# EAGLE schematic ver2.1 (EAGLE 7.1.0)
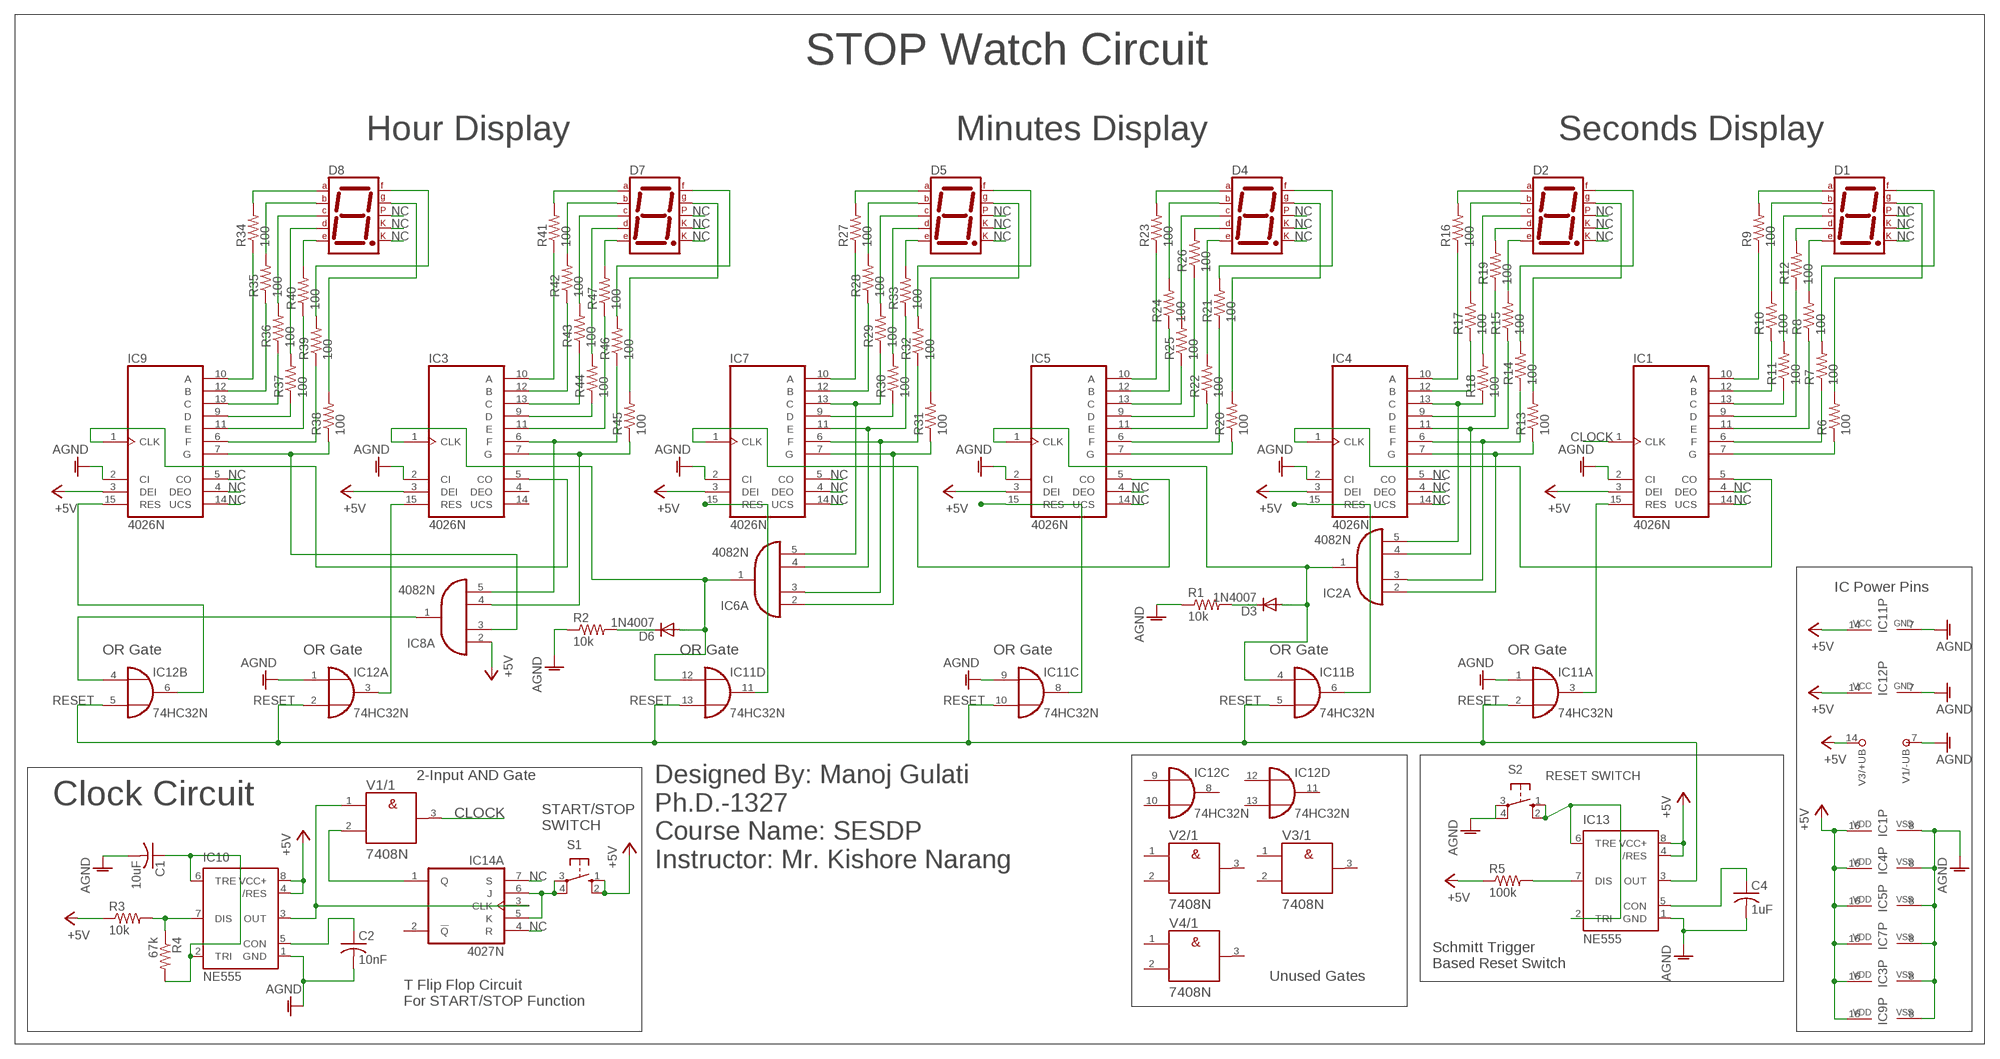
[diagram p0: schematic, sheet 1]

## Parts
C1  10uF  C-US025-024X044  [C025-024X044]
C2  10nF  C-US025-024X044  [C025-024X044]
C4  1uF  C-US025-024X044  [C025-024X044]
D1  7SEG-CK  [7SEG-13]
D2  7SEG-CK  [7SEG-13]
D3  1N4007  1N4004  [DO41-10]
D4  7SEG-CK  [7SEG-13]
D5  7SEG-CK  [7SEG-13]
D6  1N4007  1N4004  [DO41-10]
D7  7SEG-CK  [7SEG-13]
D8  7SEG-CK  [7SEG-13]
IC1  4026N  [DIL16]
IC2  4082N  [DIL14]
IC3  4026N  [DIL16]
IC4  4026N  [DIL16]
IC5  4026N  [DIL16]
IC6  4082N  [DIL14]
IC7  4026N  [DIL16]
IC8  4082N  [DIL14]
IC9  4026N  [DIL16]
IC10  NE555  [DIL-08]
IC11  74HC32N  [DIL14]
IC12  74HC32N  [DIL14]
IC13  NE555  [DIL-08]
IC14  4027N  [DIL16]
R1  10k  R-US_0204/2V  [0204V]
R2  10k  R-US_0204/2V  [0204V]
R3  10k  R-US_0204/2V  [0204V]
R4  67k  R-US_0204/2V  [0204V]
R5  100k  R-US_0204/2V  [0204V]
R6  100  R-US_0204/2V  [0204V]
R7  100  R-US_0204/2V  [0204V]
R8  100  R-US_0204/2V  [0204V]
R9  100  R-US_0204/2V  [0204V]
R10  100  R-US_0204/2V  [0204V]
R11  100  R-US_0204/2V  [0204V]
R12  100  R-US_0204/2V  [0204V]
R13  100  R-US_0204/2V  [0204V]
R14  100  R-US_0204/2V  [0204V]
R15  100  R-US_0204/2V  [0204V]
R16  100  R-US_0204/2V  [0204V]
R17  100  R-US_0204/2V  [0204V]
R18  100  R-US_0204/2V  [0204V]
R19  100  R-US_0204/2V  [0204V]
R20  100  R-US_0204/2V  [0204V]
R21  100  R-US_0204/2V  [0204V]
R22  100  R-US_0204/2V  [0204V]
R23  100  R-US_0204/2V  [0204V]
R24  100  R-US_0204/2V  [0204V]
R25  100  R-US_0204/2V  [0204V]
R26  100  R-US_0204/2V  [0204V]
R27  100  R-US_0204/2V  [0204V]
R28  100  R-US_0204/2V  [0204V]
R29  100  R-US_0204/2V  [0204V]
R30  100  R-US_0204/2V  [0204V]
R31  100  R-US_0204/2V  [0204V]
R32  100  R-US_0204/2V  [0204V]
R33  100  R-US_0204/2V  [0204V]
R34  100  R-US_0204/2V  [0204V]
R35  100  R-US_0204/2V  [0204V]
R36  100  R-US_0204/2V  [0204V]
R37  100  R-US_0204/2V  [0204V]
R38  100  R-US_0204/2V  [0204V]
R39  100  R-US_0204/2V  [0204V]
R40  100  R-US_0204/2V  [0204V]
R41  100  R-US_0204/2V  [0204V]
R42  100  R-US_0204/2V  [0204V]
R43  100  R-US_0204/2V  [0204V]
R44  100  R-US_0204/2V  [0204V]
R45  100  R-US_0204/2V  [0204V]
R46  100  R-US_0204/2V  [0204V]
R47  100  R-US_0204/2V  [0204V]
S1  10-XX  [B3F-10XX]
S2  10-XX  [B3F-10XX]
V1  7408N  [DIL14]
V2  7408N  [DIL14]
V3  7408N  [DIL14]
V4  7408N  [DIL14]

## Nets
+5V: IC1.3(DEI) IC1.16(VDD) IC3.3(DEI) IC3.16(VDD) IC4.3(DEI) IC4.16(VDD) IC5.3(DEI) IC5.16(VDD) IC7.3(DEI) IC7.16(VDD) IC8.2(A:I0) IC9.3(DEI) IC9.16(VDD) IC10.4(/RES) IC10.8(VCC+) IC11.14(P:VCC) IC12.14(P:VCC) IC13.4(/RES) IC13.8(VCC+) R3.1 R5.1 S1.1(S) S1.2(S1) V3.14(/+UB:+UB)
AGND: C1.2 C2.2 C4.2 IC1.2(CI) IC1.8(VSS) IC3.2(CI) IC3.8(VSS) IC4.2(CI) IC4.8(VSS) IC5.2(CI) IC5.8(VSS) IC7.2(CI) IC7.8(VSS) IC9.2(CI) IC9.8(VSS) IC10.1(GND) IC11.1(A:I0) IC11.7(P:GND) IC11.9(C:I0) IC12.1(A:I0) IC12.7(P:GND) IC13.1(GND) R1.1 R2.1 S2.3(P) S2.4(P1) V1.7(/-UB:-UB)
CLOCK: IC1.1(CLK) V1.3(/1:Y)
N$1: IC1.10(A) R9.1
N$2: IC1.12(B) R10.1
N$3: D1.4(C) R11.2
N$4: IC1.9(D) R12.1
N$5: IC1.11(E) R8.1
N$6: D1.9(F) R7.2
N$7: D1.10(G) R6.2
N$8: IC4.10(A) R16.1
N$9: IC4.12(B) R17.1
N$10: IC2.5(A:I3) IC4.13(C) R18.1
N$11: IC4.9(D) R19.1
N$12: IC2.4(A:I2) IC4.11(E) R15.1
N$13: IC2.3(A:I1) IC4.6(F) R14.1
N$14: IC2.2(A:I0) IC4.7(G) R13.1
N$15: IC1.5(CO) IC4.1(CLK)
N$16: D3.C R1.2
N$17: D3.A IC2.1(A:O) IC5.1(CLK)
N$18: IC3.10(A) R41.1
N$19: IC5.10(A) R23.1
N$20: IC5.12(B) R24.1
N$21: D4.4(C) R25.2
N$22: IC5.9(D) R26.1
N$23: D4.1(E) R22.2
N$24: D4.9(F) R21.2
N$25: D4.10(G) R20.2
N$26: IC7.10(A) R27.1
N$27: IC7.12(B) R28.1
N$28: IC6.5(A:I3) IC7.13(C) R29.1
N$29: D5.2(D) R30.2
N$30: IC6.4(A:I2) IC7.11(E) R33.1
N$31: IC6.3(A:I1) IC7.6(F) R32.1
N$32: IC6.2(A:I0) IC7.7(G) R31.1
N$33: IC5.5(CO) IC7.1(CLK)
N$34: D6.A IC3.1(CLK) IC6.1(A:O) IC11.12(D:I0)
N$35: D6.C R2.2
N$36: IC3.12(B) R42.1
N$37: D7.4(C) R43.2
N$38: D7.2(D) R44.2
N$39: IC3.11(E) R47.1
N$40: IC3.7(G) IC8.4(A:I2) R45.1
N$41: C1.1 IC10.2(TRI) IC10.6(TRE) R4.2
N$42: IC9.10(A) R34.1
N$43: IC9.12(B) R35.1
N$44: D8.4(C) R36.2
N$45: D8.2(D) R37.2
N$46: IC9.11(E) R40.1
N$47: D8.9(F) R39.2
N$48: IC8.3(A:I1) IC9.7(G) R38.1
N$49: IC3.5(CO) IC9.1(CLK)
N$50: IC8.1(A:O) IC12.4(B:I0)
N$51: C2.1 IC10.5(CON)
N$52: IC10.3(OUT) IC14.3(A:CLK) V1.1(/1:A)
N$53: IC1.15(RES) IC11.3(A:O)
N$54: IC4.15(RES) IC11.6(B:O)
N$55: IC10.7(DIS) R3.2 R4.1
N$56: IC5.15(RES) IC11.8(C:O)
N$57: IC7.15(RES) IC11.11(D:O)
N$58: IC3.15(RES) IC12.3(A:O)
N$59: IC9.15(RES) IC12.6(B:O)
N$60: D2.5(DP)
N$61: D2.3(CK1)
N$62: D2.8(CK2)
N$64: IC13.7(DIS) R5.2
N$65: IC13.2(TRI) IC13.6(TRE) S2.1(S) S2.2(S1)
N$66: C4.1 IC13.5(CON)
N$67: IC14.5(A:K) IC14.6(A:J) S1.3(P) S1.4(P1)
N$68: IC4.5(CO)
N$69: IC14.1(A:Q) V1.2(/1:B)
N$70: IC4.4(DEO)
N$71: IC4.14(UCS)
N$72: IC1.4(DEO)
N$73: IC1.14(UCS)
N$74: IC7.5(CO)
N$75: IC7.4(DEO)
N$76: IC7.14(UCS)
N$77: IC9.5(CO)
N$78: IC9.4(DEO)
N$79: IC9.14(UCS)
N$80: IC14.4(A:R)
N$81: IC14.7(A:S)
N$82: IC5.4(DEO)
N$83: IC5.14(UCS)
N$84: IC3.6(F) IC8.5(A:I3) R46.1
N$85: IC1.7(G) R6.1
N$86: IC1.6(F) R7.1
N$87: D1.1(E) R8.2
N$88: D1.7(A) R9.2
N$89: D1.6(B) R10.2
N$90: IC1.13(C) R11.1
N$91: D1.2(D) R12.2
N$92: D2.9(F) R14.2
N$93: D2.10(G) R13.2
N$94: D2.1(E) R15.2
N$95: D2.7(A) R16.2
N$96: D2.6(B) R17.2
N$97: D2.4(C) R18.2
N$98: D2.2(D) R19.2
N$99: IC5.7(G) R20.1
N$100: IC5.6(F) R21.1
N$101: IC5.11(E) R22.1
N$102: D4.7(A) R23.2
N$103: D4.6(B) R24.2
N$104: IC5.13(C) R25.1
N$105: D4.2(D) R26.2
N$106: D5.7(A) R27.2
N$107: D5.6(B) R28.2
N$108: D5.4(C) R29.2
N$109: IC7.9(D) R30.1
N$110: D5.10(G) R31.2
N$111: D5.9(F) R32.2
N$112: D5.1(E) R33.2
N$113: D1.5(DP)
N$114: D1.3(CK1)
N$115: D1.8(CK2)
N$116: D8.6(B) R35.2
N$117: D8.7(A) R34.2
N$118: IC9.13(C) R36.1
N$119: IC9.9(D) R37.1
N$120: D8.10(G) R38.2
N$121: IC9.6(F) R39.1
N$122: D7.6(B) R42.2
N$123: IC3.13(C) R43.1
N$124: D7.7(A) R41.2
N$125: IC3.9(D) R44.1
N$126: D7.10(G) R45.2
N$127: D7.9(F) R46.2
N$128: D7.1(E) R47.2
N$129: D8.1(E) R40.2
RESET: IC11.2(A:I1) IC11.5(B:I1) IC11.10(C:I1) IC11.13(D:I1) IC12.2(A:I1) IC12.5(B:I1) IC13.3(OUT)
Unconnected: D4.3(CK1) D4.5(DP) D4.8(CK2) D5.3(CK1) D5.5(DP) D5.8(CK2) D7.3(CK1) D7.5(DP) D7.8(CK2) D8.3(CK1) D8.5(DP) D8.8(CK2) IC2.9(B:I0) IC2.10(B:I1) IC2.11(B:I2) IC2.12(B:I3) IC2.13(B:O) IC3.4(DEO) IC3.14(UCS) IC6.9(B:I0) IC6.10(B:I1) IC6.11(B:I2) IC6.12(B:I3) IC6.13(B:O) IC8.9(B:I0) IC8.10(B:I1) IC8.11(B:I2) IC8.12(B:I3) IC8.13(B:O) IC11.4(B:I0) IC12.8(C:O) IC12.9(C:I0) IC12.10(C:I1) IC12.11(D:O) IC12.12(D:I0) IC12.13(D:I1) IC14.2(A:!Q) IC14.9(B:S) IC14.10(B:J) IC14.11(B:K) IC14.12(B:R) IC14.13(B:CLK) IC14.14(B:!Q) IC14.15(B:Q) V1.4(/2:A) V1.5(/2:B) V1.6(/2:Y) V1.8(/3:Y) V1.9(/3:A) V1.10(/3:B) V1.11(/4:Y) V1.12(/4:A) V1.13(/4:B) V2.1(/1:A) V2.2(/1:B) V2.3(/1:Y) V2.4(/2:A) V2.5(/2:B) V2.6(/2:Y) V2.8(/3:Y) V2.9(/3:A) V2.10(/3:B) V2.11(/4:Y) V2.12(/4:A) V2.13(/4:B) V3.1(/1:A) V3.2(/1:B) V3.3(/1:Y) V3.4(/2:A) V3.5(/2:B) V3.6(/2:Y) V3.8(/3:Y) V3.9(/3:A) V3.10(/3:B) V3.11(/4:Y) V3.12(/4:A) V3.13(/4:B) V4.1(/1:A) V4.2(/1:B) V4.3(/1:Y) V4.4(/2:A) V4.5(/2:B) V4.6(/2:Y) V4.8(/3:Y) V4.9(/3:A) V4.10(/3:B) V4.11(/4:Y) V4.12(/4:A) V4.13(/4:B)

## Notes on the sheet
- STOP Watch Circuit
- Hour Display | Minutes Display | Seconds Display
- NC | NC | NC | NC | NC | NC
- NC | NC | NC | NC | NC | NC
- NC | NC | NC | NC | NC | NC
- NC | NC | NC
- NC | NC | NC | NC | NC
- NC | NC | NC | NC | NC
- IC Power Pins
- OR Gate | OR Gate | OR Gate | OR Gate | OR Gate | OR Gate
- 2-Input AND Gate | RESET SWITCH
- Clock Circuit
- START/STOP
  SWITCH
- Designed By: Manoj Gulati
  Ph.D.-1327
  Course Name: SESDP
  Instructor: Mr. Kishore Narang
- NC
- NC
- Schmitt Trigger 
  Based Reset Switch
- Unused Gates
- T Flip Flop Circuit
  For START/STOP Function

## Power pins joined to a net without a drawn wire
+UB: V1.14(/+UB:+UB) V2.14(/+UB:+UB) V4.14(/+UB:+UB)
-UB: V2.7(/-UB:-UB) V3.7(/-UB:-UB) V4.7(/-UB:-UB)
VDD: IC2.14(P:VDD) IC6.14(P:VDD) IC8.14(P:VDD) IC14.16(P:VDD)
VSS: IC2.7(P:VSS) IC6.7(P:VSS) IC8.7(P:VSS) IC14.8(P:VSS)

## Library data of the parts
C1 C2 C4 = rcl:C-US: CAPACITOR, American symbol
D1 D2 D4 D5 D7 D8 = special:7SEG-CK: 7-segment DISPLAY single cathode, 13 mm
D3 D6 = diode:1N4004: DIODE general purpose rectifier, 1 A
IC1 IC3-IC5 IC7 IC9 = 40xx:4026: Decade COUNTER/DIVIDER, 7-seg. outputs
IC2 IC6 IC8 = 40xx:4082: Dual 4-input AND
IC10 IC13 = st-microelectronics:NE555: General purpose bipolar Timer; MF: Arrow Electronics; MPN: NE555N; OC_FARNELL: 1467742; OC_NEWARK: 89K1486
IC11 IC12 = 74xx-eu:74*32: Quad 2-input OR gate
IC14 = 40xx:4027: Dual JK FLIP FLOP
R1-R47 = resistor:R-US_: RESISTOR, American symbol
S1 S2 = switch-omron:10-XX: OMRON SWITCH; MPN: B3F-1000; OC_FARNELL: 176432; OC_NEWARK: 36M3542
V1-V4 = 74ttl-din:74*08: Quad 2-input AND gate